# Altium schematic sheet LCD4.3.SchDoc: LCD 4.3"
size A4; Date: Not used; ApprovedBy: Not used; CheckedBy: Not used; Author: Not used; CompanyName: STMicroelectronics; DrawnBy: Not used; Engineer: Not used; Organization: Not used; Address1: Not used; Address2: Not used; Address3: Not used; Address4: Not used; DocumentNumber: 10; Revision: Not used; SheetNumber: 10; SheetTotal: 17; CurrentTime: Not used; CurrentDate: Not used; Time: Not used; DocumentFullPathAndName: Not used; DocumentName: Not used; ModifiedDate: Not used; ImagePath: Not used; ProjectName: Not used; Application_BuildNumber: Not used
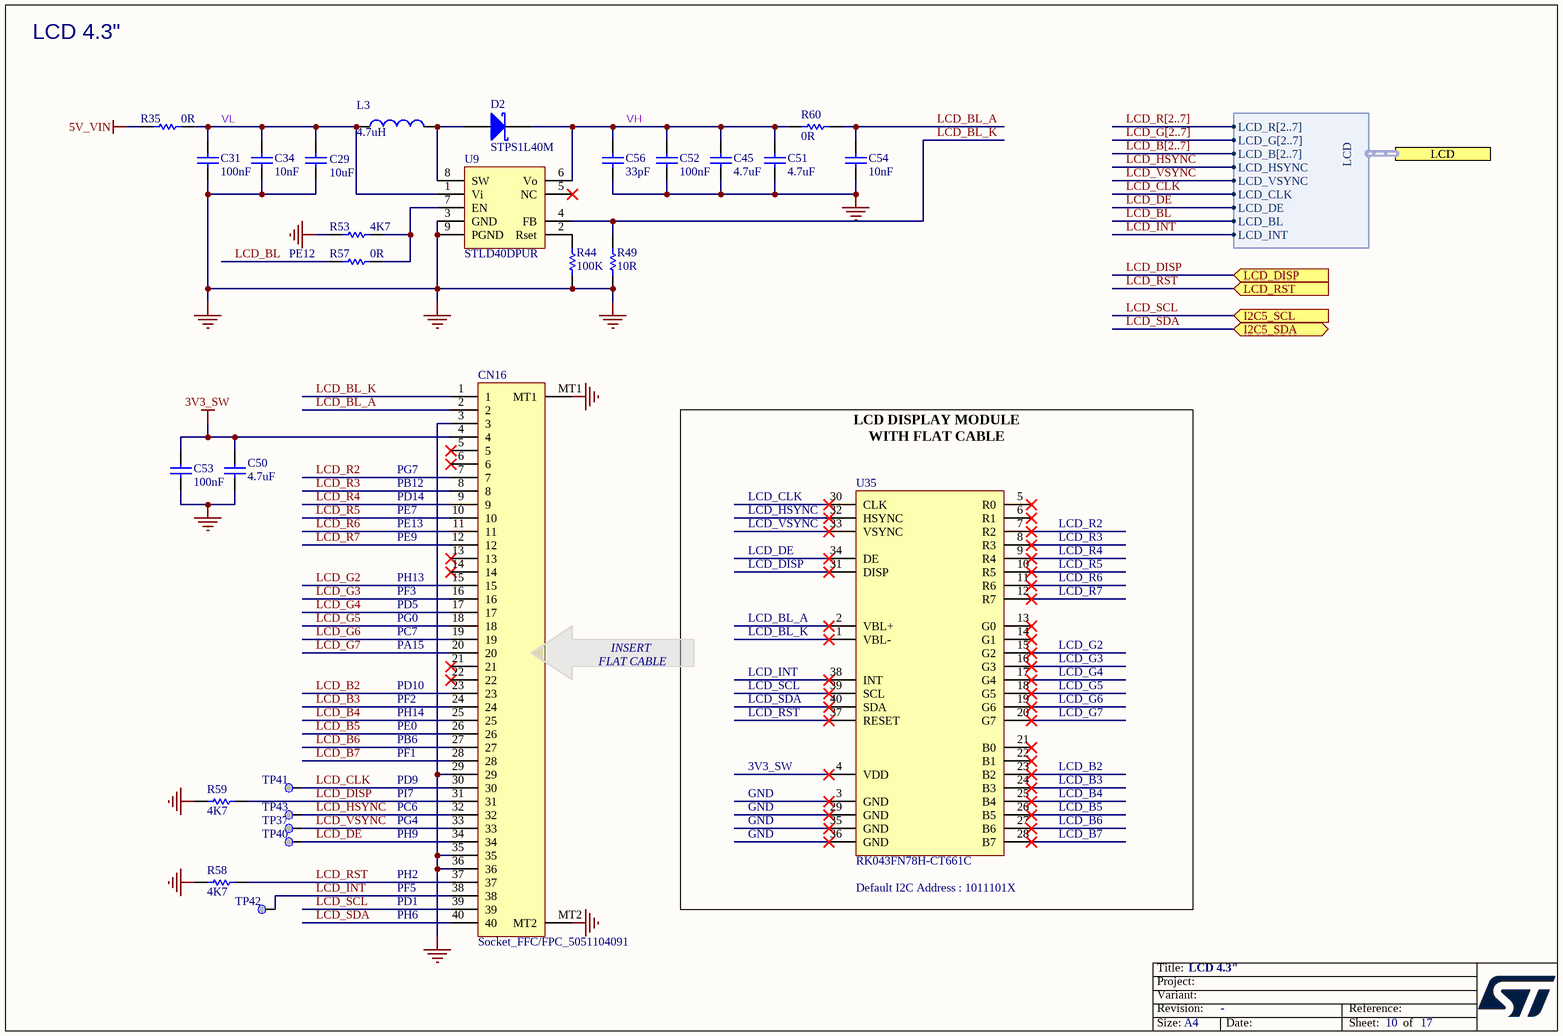
[diagram p0: LCD4.3.SchDoc]

## Parts
C29  value 10uF  [C0603]  (hidden comment: Capacitor)
C31  value 100nF  [C0402]  (hidden comment: Capacitor)
C34  value 10nF  [C0402]  (hidden comment: Capacitor)
C45  value 4.7uF  [C1206_H1P25]  (hidden comment: Capacitor)
C50  value 4.7uF  [C0402]  (hidden comment: Capacitor)
C51  value 4.7uF  [C1206_H1P25]  (hidden comment: Capacitor)
C52  value 100nF  [C0603]  (hidden comment: Capacitor)
C53  value 100nF  [C0402]  (hidden comment: Capacitor)
C54  value 10nF  [C0402]  (hidden comment: Capacitor)
C56  value 33pF  [C0402]  (hidden comment: Capacitor)
CN16  value Socket_FFC/FPC_5051104091  [CON_MOLEX_5051104091]  (hidden comment: 5051104091)
D2  STPS1L40M  [DIO_DO216-AA]
L3  value 4.7uH  [L1210_LQH]  (hidden comment: Inductor)
R35  value 0R  [R0603]  (hidden comment: Resistor)
R44  value 100K  [R0402]  (hidden comment: Resistor)
R49  value 10R  [R0603]  (hidden comment: Resistor)
R53  value 4K7  [R0402]  (hidden comment: Resistor)
R57  value 0R  [R0402]  (hidden comment: Resistor)
R58  value 4K7  [R0402]  (hidden comment: Resistor)
R59  value 4K7  [R0402]  (hidden comment: Resistor)
R60  value 0R  [R0402]  (hidden comment: Resistor)
TP37  Test Point  [TP_SMD_1MM]  (value not drawn)  (no BOM)
TP40  Test Point  [TP_SMD_1MM]  (value not drawn)  (no BOM)
TP41  Test Point  [TP_SMD_1MM]  (value not drawn)  (no BOM)
TP42  Test Point  [TP_SMD_1MM]  (value not drawn)  (no BOM)
TP43  Test Point  [TP_SMD_1MM]  (value not drawn)  (no BOM)
U9  STLD40DPUR  [ICC_QFN8-EPAD_3X3_P065]
U35  RK043FN78H-CT661C  [LCD_DRAWING_ROCKTEK_RK043FN78H-CT661C]

## Ports
I2C5_SCL (in), I2C5_SDA (bidir), LCD (harness LCD), LCD_DISP (in), LCD_RST (in)

## Harnesses
LCD: LCD_R[2..7], LCD_G[2..7], LCD_B[2..7], LCD_HSYNC, LCD_VSYNC, LCD_DE, LCD_CLK, LCD_BL, LCD_INT

## Nets
3V3_SW: C50.1 C53.2 CN16.4
5V_VIN: R35.1
GND: C29.2 C31.1 C34.1 C45.1 C50.2 C51.1 C52.1 C53.1 C54.1 C56.1 CN16.3 CN16.29 CN16.35 CN16.36 CN16.MT1 CN16.MT2 R44.1 R49.1 R53.1 R58.2 R59.1 U9.3(GND) U9.9(PGND)
LCD_B2: CN16.23
LCD_B3: CN16.24
LCD_B4: CN16.25
LCD_B5: CN16.26
LCD_B6: CN16.27
LCD_B7: CN16.28
LCD_BL: R57.1 ; port LCD.LCD_BL
LCD_BL_A: C54.2 CN16.2 R60.2
LCD_BL_K: CN16.1 R49.2 U9.4(FB)
LCD_CLK: CN16.30 TP41.1 ; port LCD.LCD_CLK
LCD_DE: CN16.34 TP40.1 ; port LCD.LCD_DE
LCD_DISP: CN16.31 R59.2 ; port LCD_DISP
LCD_G2: CN16.15
LCD_G3: CN16.16
LCD_G4: CN16.17
LCD_G5: CN16.18
LCD_G6: CN16.19
LCD_G7: CN16.20
LCD_HSYNC: CN16.32 TP43.1 ; port LCD.LCD_HSYNC
LCD_INT: CN16.38 TP42.1 ; port LCD.LCD_INT
LCD_R2: CN16.7
LCD_R3: CN16.8
LCD_R4: CN16.9
LCD_R5: CN16.10
LCD_R6: CN16.11
LCD_R7: CN16.12
LCD_RST: CN16.37 R58.1 ; port LCD_RST
LCD_SCL: CN16.39 ; port I2C5_SCL
LCD_SDA: CN16.40 ; port I2C5_SDA
LCD_VSYNC: CN16.33 TP37.1 ; port LCD.LCD_VSYNC
VH: C45.2 C51.2 C52.2 C56.2 D2.2(K) R60.1 U9.6(Vo)
VL: C29.1 C31.2 C34.2 L3.1 R35.2 U9.1(Vi)
NetD2_1: D2.1(A) L3.2 U9.8(SW)
NetR44_2: R44.2 U9.2(Rset)
NetR53_2: R53.2 R57.2 U9.7(EN)

Not connected (* = marked no-connect by the designer): CN16 5* 6* 13* 14* 21* 22*; U9 5(NC)*; U35 1(VBL-)* 2(VBL+)* 3(GND)* 4(VDD)* 5(R0)* 6(R1)* 7(R2)* 8(R3)* 9(R4)* 10(R5)* 11(R6)* 12(R7)* 13(G0)* 14(G1)* 15(G2)* 16(G3)* 17(G4)* 18(G5)* 19(G6)* 20(G7)* 21(B0)* 22(B1)* 23(B2)* 24(B3)* 25(B4)* 26(B5)* 27(B6)* 28(B7)* 29(GND)* 30(CLK)* 31(DISP)* 32(HSYNC)* 33(VSYNC)* 34(DE)* 35(GND)* 36(GND)* 37(RESET)* 38(INT)* 39(SCL)* 40(SDA)*

## Buses and harness runs
bus LCD_B[2..7]
bus LCD_G[2..7]
bus LCD_R[2..7]

## Notes on the sheet
- LCD 4.3"
- PE12
- PG7
- PB12
- PD14
- PE7
- LCD_CLK
- (near U35) LCD_HSYNC
- PE13
- PE9
- PH13
- (near U35) LCD_VSYNC
- LCD_DE
- LCD_DISP
- LCD_R2
- LCD_R3
- LCD_R4
- LCD_R5
- LCD_R6
- PF3
- PD5
- PG0
- PC7
- PA15
- (near CN16) INSERT
  FLAT CABLE
- LCD_BL_A
- LCD_BL_K
- LCD_R7
- LCD_G2
- PD10
- PF2
- PH14
- LCD_INT
- LCD_RST
- LCD_SCL
- LCD_SDA
- LCD_G3
- LCD_G4
- LCD_G5
- LCD_G6
- LCD_G7
- PE0
- PB6
- PF1
- PD9
- 3V3_SW
- LCD_B2
- LCD_B3
- PG4
- PC6
- PH9
- PI7
- GND
- LCD_B4
- LCD_B5
- LCD_B6
- LCD_B7
- PH6
- PD1
- PF5
- PH2
- (near U35) LCD DISPLAY MODULE
  WITH FLAT CABLE
- (near U35) Default I2C Address : 1011101X
- Title:
- Project:
- Size:
- Revision:
- Variant:
- A4
- -
- Date:
- Reference:
- Sheet:
- of

## Library data of the parts
C29 = MCD-00099: Capacitor, MLCC, 10uF, 10V, X5R, +/-10%, 0603, T=0.8mm; Manufacturer_Part_Number: GRM188R61A106KE69D; Manufacturer: MURATA; Part_Preference: Recommended; Order_Code_RS: 170-6168; Component_Country_Of_Origin: Japan; ShowFields: YES; ID: 2770; Internal_Part_Number: MCD-00099; Status: Released; Part_Type: Capacitor; ComponentLink1URL: http://tunmcdsvn.tun.st.com/Component_Documentation_Library/Trunk/Capacitor/MURATA_GRM_Series; Order_Code_Digikey: 490-10474-1-ND; Order_Code_Farnell: 2494233; Package: 0603
C31 C53 = MCD-00006: Capacitor, MLCC, 100nF, 16V, X7R, +/-10%, 0402, T=0.5mm; Manufacturer_Part_Number: CC0402KRX7R7BB104; Manufacturer: YAGEO; Part_Preference: Recommended; Order_Code_RS: 616-9701; Component_Country_Of_Origin: China; ShowFields: YES; ID: 2474; Internal_Part_Number: MCD-00006; Status: Released; Part_Type: Capacitor; Package: 0402; ComponentLink1URL: http://tunmcdsvn.tun.st.com/Component_Documentation_Library/Trunk/Capacitor/YAGEO_X7R_Series; Order_Code_Digikey: 311-1338-1-ND; Order_Code_Farnell: 9402047
C34 C54 = MCD-02198: Capacitor, MLCC, 10nF, 50V, X7R, +/-10%, 0402, T=0.5mm; Manufacturer_Part_Number: CC0402KRX7R9BB103; Manufacturer: YAGEO; Part_Preference: Recommended; Order_Code_RS: 6169644; Component_Country_Of_Origin: China; ShowFields: YES; ID: 4298; Internal_Part_Number: MCD-02198; Status: Checked; Part_Type: Capacitor; Package: 0402; ComponentLink1URL: http://tunmcdsvn.tun.st.com/Component_Documentation_Library/Trunk/Capacitor/YAGEO_X7R_Series; Order_Code_Digikey: N/A; Order_Code_Farnell: N/A
C45 C51 = MCD-00013: Capacitor, MLCC, 4.7uF, 50V, X7R, +/-10%, 1206, T=1.27mm; Manufacturer_Part_Number: 12065C475KAT2A; Manufacturer: AVX; Part_Preference: Recommended; Order_Code_RS: 178-0947; Component_Country_Of_Origin: China, Penang; ShowFields: YES; ID: 2466; Internal_Part_Number: MCD-00013; Status: Released; Part_Type: Capacitor; Package: 1206; ComponentLink1URL: http://tunmcdsvn.tun.st.com/Component_Documentation_Library/Trunk/Capacitor/AVX_CG0_NP0_Series; Order_Code_Digikey: 478-6653-1-ND; Order_Code_Farnell: 1908177
C50 = MCD-01356: Capacitor, MLCC, 4.7uF, 6V3, X5R, +/-20%, 0402, T=0.5mm; Manufacturer_Part_Number: GRM155R60J475ME47; Manufacturer: MURATA; Part_Preference: Recommended; Order_Code_RS: 814-5230; Component_Country_Of_Origin: Japan; ShowFields: YES; ID: 3456; Internal_Part_Number: MCD-01356; Status: Released; Part_Type: Capacitor; ComponentLink1URL: http://tunmcdsvn.tun.st.com/Component_Documentation_Library/Trunk/Capacitor/MURATA_GRM_Series; Order_Code_Digikey: 490-5915-1-ND; Order_Code_Farnell: 2666407; Package: 0402
C52 = MCD-01099: Capacitor, MLCC, 100nF, 50V, X7R, +/-10%, 0603, T=0.8mm; BMS_Part_Number: 9142278; Part_Preference: Recommended; Manufacturer: YAGEO; Manufacturer_Part_Number: CC0603KRX7R9BB104; Order_Code_RS: 669-8767; Component_Country_Of_Origin: China; ShowFields: YES; ID: 3397; Internal_Part_Number: MCD-01099; Status: Released; Part_Type: Capacitor; Package: 0603; ComponentLink1URL: http://tunmcdsvn.tun.st.com/Component_Documentation_Library/Trunk/Capacitor/YAGEO_X7R_Series; Order_Code_Digikey: 311-1344-1-ND; Order_Code_Farnell: 1362556
C56 = MCD-00277: Capacitor, MLCC, 33pF, 50V, NPO,+/-5%, 0402, T=0.5mm; Part_Preference: Recommended; Manufacturer: YAGEO; Manufacturer_Part_Number: CC0402JRNPO9BN330; Component_Country_Of_Origin: China; ShowFields: YES; ID: 2592; Internal_Part_Number: MCD-00277; Status: Released; Part_Type: Capacitor; Package: 0402; ComponentLink1URL: http://tunmcdsvn.tun.st.com/Component_Documentation_Library/Trunk/Capacitor/YAGEO_NP0_Series; Order_Code_Digikey: 311-1020-1-ND; Order_Code_Farnell: 3019196; Order_Code_RS: N/A
CN16 = MCD-02589: Socket_FFC/FPC, 40pins, 0.5mm, RA, SMD, T=1.9mm; Part_Type: Connector; Part_Preference: Recommended; Manufacturer: MOLEX; Order_Code_RS: 178-8776; ShowFields: YES; ID: 4695; Status: Checked; ComponentLink1URL: http://tunmcdsvn.tun.st.com/Component_Documentation_Library/Trunk/Connector/MOLEX_505110_Series; Internal_Part_Number: MCD-02589; Manufacturer_Part_Number: 5051104091; Order_Code_Digikey: WM11292; Order_Code_Farnell: 3051373
D2 = MCD-00033: Low Drop power Schottky rectifier(1A, 40V, 0.4V); Part_Type: Diode; Manufacturer: STMICROELECTRONICS; BMS_Part_Number: 9151085; Part_Preference: Recommended; Manufacturer_HQ_COO: EU; Component_Country_Of_Origin: China; ShowFields: YES; ID: 2485; Internal_Part_Number: MCD-00033; Value: STPS1L40M; Status: Released; Manufacturer_Part_Number: STPS1L40M; ComponentLink1URL: http://tunmcdsvn.tun.st.com/Component_Datasheet_Library/Trunk/Diodes/STM_Diode_STPS1L40M_DO216-AA
L3 = MCD-00048: Inductor, 4.7uH, +/-30%, 1A, 180mR, 1210, T=1.7mm; Manufacturer_Part_Number: LQH32PN4R7NN0L; Manufacturer: MURATA; Part_Preference: Recommended; Order_Code_RS: 167-4086; Component_Country_Of_Origin: Japan; ShowFields: YES; ID: 2544; Internal_Part_Number: MCD-00048; Status: Released; Part_Type: Inductor; ComponentLink1URL: http://tunmcdsvn.tun.st.com/Component_Documentation_Library/Trunk/Inductor/MURATA_LQH32PN4R7NN0; Package: 1210; Order_Code_Digikey: 490-5338-2-ND; Order_Code_Farnell: 2470296
R35 = MCD-00181: Resistor, 0R, 0603, +/- 0.5mR, 1/4W; Part_Preference: Recommended; Manufacturer: ROHM; Manufacturer_Part_Number: PMR03EZPJ000; Component_Country_Of_Origin: Philippines, Thailand; ShowFields: YES; ID: 2691; Internal_Part_Number: MCD-00181; Status: Released; Part_Type: Resistor; Package: 0603; ComponentLink1URL: http://tunmcdsvn.tun.st.com/Component_Documentation_Library/Trunk/Resistor/ROHM_PMR_Series; Order_Code_Digikey: PMR03EZPJ000-ND; Order_Code_Farnell: N/A; Order_Code_RS: N/A
R44 = MCD-00059: Resistor, 100K, 0402, +/-1%, 1/16W; Manufacturer_Part_Number: RC0402FR-07100KL; Manufacturer: YAGEO; Part_Preference: Recommended; Component_Country_Of_Origin: China; ShowFields: YES; ID: 2533; Internal_Part_Number: MCD-00059; Status: Released; Part_Type: Resistor; Package: 0402; ComponentLink1URL: http://tunmcdsvn.tun.st.com/Component_Documentation_Library/Trunk/Resistor/YAGEO_RC_L_Series; Order_Code_Digikey: 311-100KLRTR-ND; Order_Code_Farnell: 2421891; Order_Code_RS: N/A
R49 = MCD-00060: Resistor, 10R, 0603, +/-1%, 1/4W; Manufacturer_Part_Number: ESR03EZPF10R0; Manufacturer: ROHM; Part_Preference: Recommended; Order_Code_RS: 167-3753; Component_Country_Of_Origin: Philippines, Thailand; ShowFields: YES; ID: 2531; Internal_Part_Number: MCD-00060; Status: Released; Part_Type: Resistor; Package: 0603; ComponentLink1URL: http://tunmcdsvn.tun.st.com/Component_Documentation_Library/Trunk/Resistor/ROHM_ESR_Series; Order_Code_Digikey: RHM10.0ADCT-ND; Order_Code_Farnell: 2887146
R53 R58 R59 = MCD-00065: Resistor, 4K7, 0402, +/-1%, 1/16W; Manufacturer_Part_Number: RC0402FR-074K7L; Manufacturer: YAGEO; Part_Preference: Recommended; Component_Country_Of_Origin: China; ShowFields: YES; ID: 2526; Internal_Part_Number: MCD-00065; Status: Released; Part_Type: Resistor; Package: 0402; ComponentLink1URL: http://tunmcdsvn.tun.st.com/Component_Documentation_Library/Trunk/Resistor/YAGEO_RC_L_Series; Order_Code_Digikey: 311-4.7KLRCT-ND; Order_Code_Farnell: 9239316; Order_Code_RS: N/A
R57 = MCD-00052: Resistor, 0R, 0402, +/-5%, 1/16W; Manufacturer_Part_Number: RC0402JR-070RL; Manufacturer: YAGEO; Part_Preference: Recommended; Order_Code_RS: 618-5804; Component_Country_Of_Origin: China; ShowFields: YES; ID: 2540; Internal_Part_Number: MCD-00052; Status: Released; Part_Type: Resistor; Package: 0402; ComponentLink1URL: http://tunmcdsvn.tun.st.com/Component_Documentation_Library/Trunk/Resistor/YAGEO_RC_L_Series; Order_Code_Digikey: 311-0.0JRCT-ND; Order_Code_Farnell: 9232516RL
R60 = MCD-00052: Resistor, 0R, 0402, +/-5%, 1/16W; Part_Preference: Recommended; Manufacturer: YAGEO; Manufacturer_Part_Number: RC0402JR-070RL; Order_Code_RS: 618-5804; Component_Country_Of_Origin: China; ShowFields: YES; ID: 2540; Internal_Part_Number: MCD-00052; Status: Released; Part_Type: Resistor; Package: 0402; ComponentLink1URL: http://tunmcdsvn.tun.st.com/Component_Documentation_Library/Trunk/Resistor/YAGEO_RC_L_Series; Order_Code_Digikey: 311-0.0JRCT-ND; Order_Code_Farnell: 9232516RL
TP37 TP40-TP43 = MCD-00074: Test Point 1mm; Part_Type: Misc; Part_Preference: Recommended; ShowFields: YES; ID: 2518; Internal_Part_Number: MCD-00074; Status: Released; Manufacturer_Part_Number: N/A; Manufacturer: N/A; ComponentLink1URL: http://na; Order_Code_Digikey: N/A; Order_Code_Farnell: N/A; Order_Code_RS: N/A
U9 = MCD-00082: White LED power supply for large display backlight, QFN8; Part_Type: IC; Manufacturer: STMICROELECTRONICS; BMS_Part_Number: 9176009; Part_Preference: Recommended; Manufacturer_HQ_COO: EU; Component_Country_Of_Origin: Malaysia; ShowFields: YES; ID: 2510; Internal_Part_Number: MCD-00082; Value: STLD40DPUR; Status: Released; Manufacturer_Part_Number: STLD40DPUR; ComponentLink1URL: http://tunmcdsvn.tun.st.com/Component_Datasheet_Library/Trunk/IC/STM_White-LED-PWR_STLD40DPUR_QFN8
U35 = MCD-02422: LCD,  TFT, 4.3 inch, 480x272 pixels with LED Backlight and Capacitive touch panel, high luminance with 0.5mm pitch flat cable; Part_Type: Display; Manufacturer_Part_Number: RK043FN78HV-CT661C; Manufacturer: ROCKTECH; Part_Preference: Recommended; Component_Country_Of_Origin: Unknown; ShowFields: YES; ID: 4528; Internal_Part_Number: MCD-02422; Value: RK043FN78H-CT661C; Status: Released; ComponentLink1URL: http://tunmcdsvn.tun.st.com/Component_Documentation_Library/Trunk/Display/ROCKTECH_RK043FN78H-CT661C; Order_code_Digikey: N/A; Order_code_Farnell: N/A; Order_code_RS: N/A